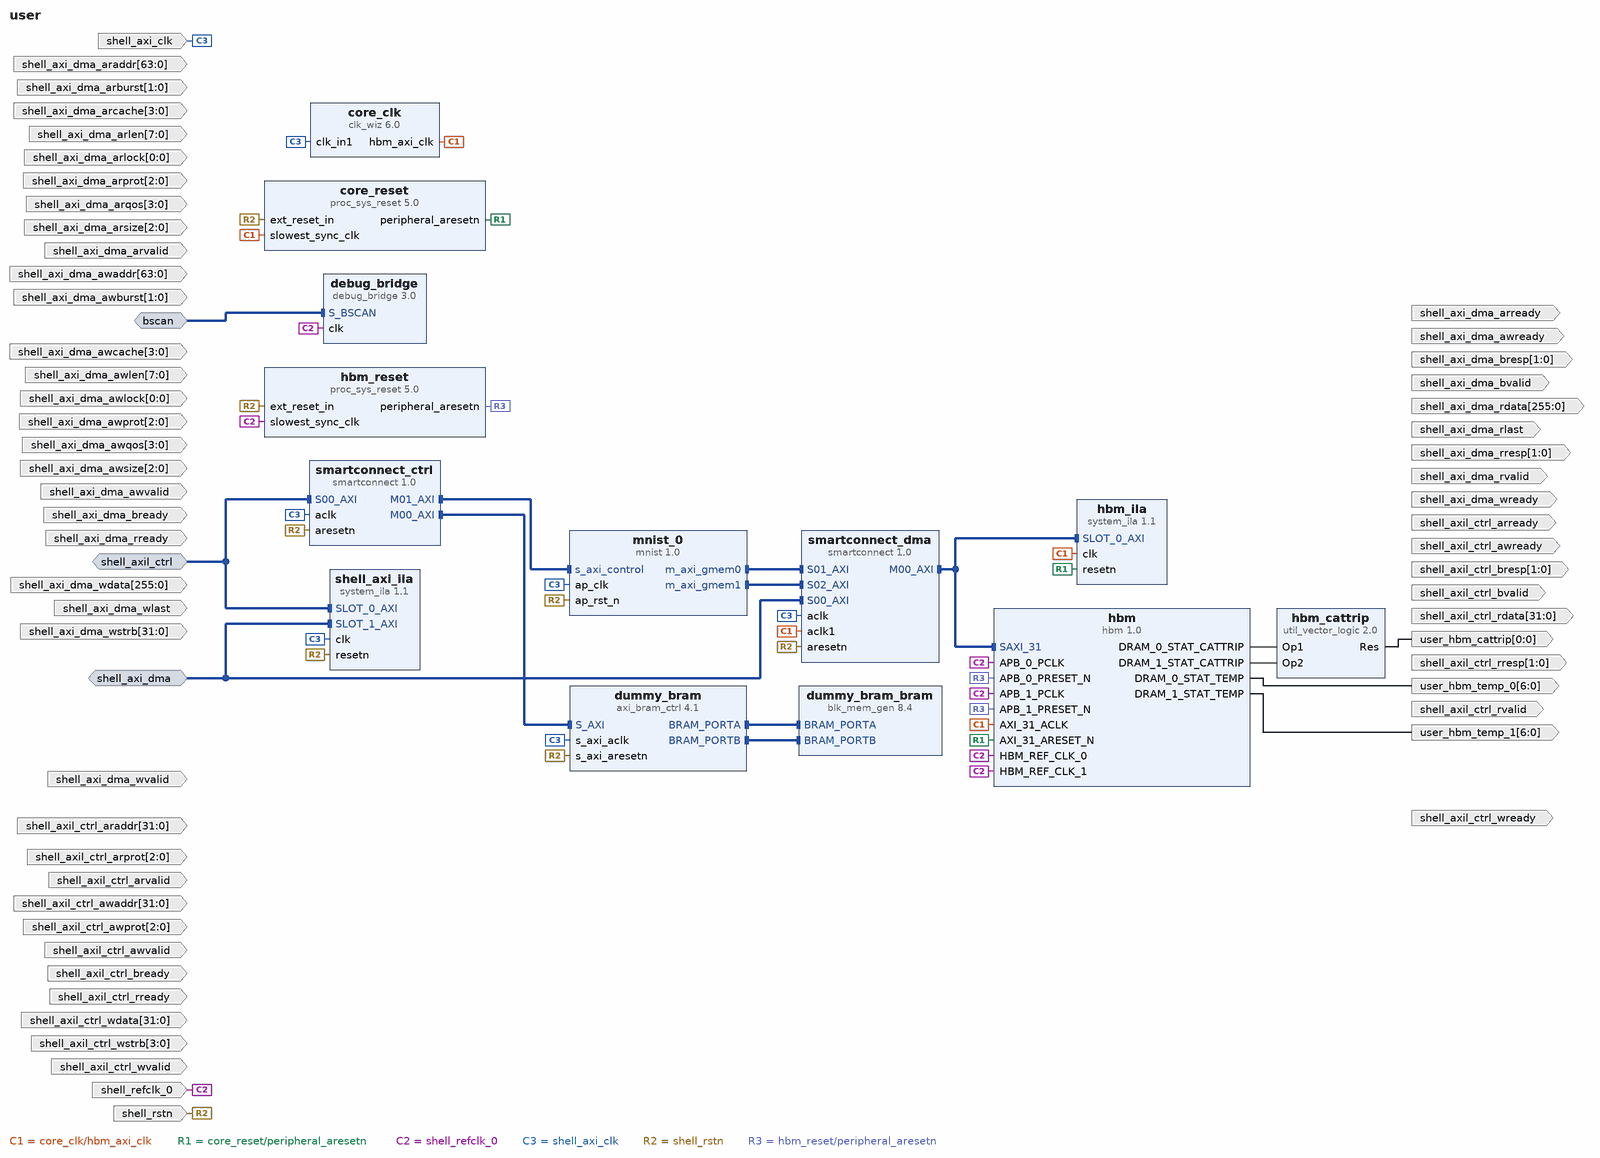
[diagram p0: block diagram of the top level]
# Vivado block design user, xcu55n-fsvh2892-2L-e, Vivado 2022.2
create_bd_design user

create_bd_intf_port -mode Slave -vlnv xilinx.com:interface:aximm_rtl:1.0 shell_axi_dma
set_property -dict [list \
  CONFIG.ADDR_WIDTH 64 \
  CONFIG.ARUSER_WIDTH 0 \
  CONFIG.AWUSER_WIDTH 0 \
  CONFIG.BUSER_WIDTH 0 \
  CONFIG.DATA_WIDTH 256 \
  CONFIG.FREQ_HZ 250000000 \
  CONFIG.HAS_BRESP 1 \
  CONFIG.HAS_BURST 1 \
  CONFIG.HAS_CACHE 1 \
  CONFIG.HAS_LOCK 1 \
  CONFIG.HAS_PROT 1 \
  CONFIG.HAS_QOS 1 \
  CONFIG.HAS_REGION 0 \
  CONFIG.HAS_RRESP 1 \
  CONFIG.HAS_WSTRB 1 \
  CONFIG.ID_WIDTH 0 \
  CONFIG.MAX_BURST_LENGTH 256 \
  CONFIG.NUM_READ_OUTSTANDING 32 \
  CONFIG.NUM_READ_THREADS 1 \
  CONFIG.NUM_WRITE_OUTSTANDING 16 \
  CONFIG.NUM_WRITE_THREADS 1 \
  CONFIG.PROTOCOL AXI4 \
  CONFIG.READ_WRITE_MODE READ_WRITE \
  CONFIG.RUSER_BITS_PER_BYTE 0 \
  CONFIG.RUSER_WIDTH 0 \
  CONFIG.SUPPORTS_NARROW_BURST 0 \
  CONFIG.WUSER_BITS_PER_BYTE 0 \
  CONFIG.WUSER_WIDTH 0 \
  CONFIG.master_id 1 \
] [get_bd_intf_ports shell_axi_dma]
create_bd_intf_port -mode Slave -vlnv xilinx.com:interface:aximm_rtl:1.0 shell_axil_ctrl
set_property -dict [list \
  CONFIG.ADDR_WIDTH 32 \
  CONFIG.ARUSER_WIDTH 0 \
  CONFIG.AWUSER_WIDTH 0 \
  CONFIG.BUSER_WIDTH 0 \
  CONFIG.DATA_WIDTH 32 \
  CONFIG.FREQ_HZ 250000000 \
  CONFIG.HAS_BRESP 1 \
  CONFIG.HAS_BURST 0 \
  CONFIG.HAS_CACHE 0 \
  CONFIG.HAS_LOCK 0 \
  CONFIG.HAS_PROT 1 \
  CONFIG.HAS_QOS 0 \
  CONFIG.HAS_REGION 0 \
  CONFIG.HAS_RRESP 1 \
  CONFIG.HAS_WSTRB 1 \
  CONFIG.ID_WIDTH 0 \
  CONFIG.MAX_BURST_LENGTH 1 \
  CONFIG.NUM_READ_OUTSTANDING 1 \
  CONFIG.NUM_READ_THREADS 1 \
  CONFIG.NUM_WRITE_OUTSTANDING 1 \
  CONFIG.NUM_WRITE_THREADS 1 \
  CONFIG.PROTOCOL AXI4LITE \
  CONFIG.READ_WRITE_MODE READ_WRITE \
  CONFIG.RUSER_BITS_PER_BYTE 0 \
  CONFIG.RUSER_WIDTH 0 \
  CONFIG.SUPPORTS_NARROW_BURST 0 \
  CONFIG.WUSER_BITS_PER_BYTE 0 \
  CONFIG.WUSER_WIDTH 0 \
  CONFIG.master_id 1 \
] [get_bd_intf_ports shell_axil_ctrl]
create_bd_intf_port -mode Slave -vlnv xilinx.com:interface:bscan_rtl:1.0 bscan
create_bd_port -dir I -from 63 -to 0 shell_axi_dma_awaddr
create_bd_port -dir I -from 7 -to 0 shell_axi_dma_awlen
create_bd_port -dir I -from 2 -to 0 shell_axi_dma_awsize
create_bd_port -dir I -from 1 -to 0 shell_axi_dma_awburst
create_bd_port -dir I -from 0 -to 0 shell_axi_dma_awlock
create_bd_port -dir I -from 3 -to 0 shell_axi_dma_awcache
create_bd_port -dir I -from 2 -to 0 shell_axi_dma_awprot
create_bd_port -dir I -from 3 -to 0 shell_axi_dma_awqos
create_bd_port -dir I shell_axi_dma_awvalid
create_bd_port -dir O shell_axi_dma_awready
create_bd_port -dir I -from 255 -to 0 shell_axi_dma_wdata
create_bd_port -dir I -from 31 -to 0 shell_axi_dma_wstrb
create_bd_port -dir I shell_axi_dma_wlast
create_bd_port -dir I shell_axi_dma_wvalid
create_bd_port -dir O shell_axi_dma_wready
create_bd_port -dir O -from 1 -to 0 shell_axi_dma_bresp
create_bd_port -dir O shell_axi_dma_bvalid
create_bd_port -dir I shell_axi_dma_bready
create_bd_port -dir I -from 63 -to 0 shell_axi_dma_araddr
create_bd_port -dir I -from 7 -to 0 shell_axi_dma_arlen
create_bd_port -dir I -from 2 -to 0 shell_axi_dma_arsize
create_bd_port -dir I -from 1 -to 0 shell_axi_dma_arburst
create_bd_port -dir I -from 0 -to 0 shell_axi_dma_arlock
create_bd_port -dir I -from 3 -to 0 shell_axi_dma_arcache
create_bd_port -dir I -from 2 -to 0 shell_axi_dma_arprot
create_bd_port -dir I -from 3 -to 0 shell_axi_dma_arqos
create_bd_port -dir I shell_axi_dma_arvalid
create_bd_port -dir O shell_axi_dma_arready
create_bd_port -dir O -from 255 -to 0 shell_axi_dma_rdata
create_bd_port -dir O -from 1 -to 0 shell_axi_dma_rresp
create_bd_port -dir O shell_axi_dma_rlast
create_bd_port -dir O shell_axi_dma_rvalid
create_bd_port -dir I shell_axi_dma_rready
create_bd_port -dir I -from 31 -to 0 shell_axil_ctrl_awaddr
create_bd_port -dir I -from 2 -to 0 shell_axil_ctrl_awprot
create_bd_port -dir I shell_axil_ctrl_awvalid
create_bd_port -dir O shell_axil_ctrl_awready
create_bd_port -dir I -from 31 -to 0 shell_axil_ctrl_wdata
create_bd_port -dir I -from 3 -to 0 shell_axil_ctrl_wstrb
create_bd_port -dir I shell_axil_ctrl_wvalid
create_bd_port -dir O shell_axil_ctrl_wready
create_bd_port -dir O -from 1 -to 0 shell_axil_ctrl_bresp
create_bd_port -dir O shell_axil_ctrl_bvalid
create_bd_port -dir I shell_axil_ctrl_bready
create_bd_port -dir I -from 31 -to 0 shell_axil_ctrl_araddr
create_bd_port -dir I -from 2 -to 0 shell_axil_ctrl_arprot
create_bd_port -dir I shell_axil_ctrl_arvalid
create_bd_port -dir O shell_axil_ctrl_arready
create_bd_port -dir O -from 31 -to 0 shell_axil_ctrl_rdata
create_bd_port -dir O -from 1 -to 0 shell_axil_ctrl_rresp
create_bd_port -dir O shell_axil_ctrl_rvalid
create_bd_port -dir I shell_axil_ctrl_rready
create_bd_port -dir I -type clk shell_axi_clk
set_property -dict [list \
  CONFIG.ASSOCIATED_BUSIF shell_axi_dma:shell_axil_ctrl \
  CONFIG.ASSOCIATED_RESET shell_rstn \
  CONFIG.FREQ_HZ 250000000 \
] [get_bd_ports shell_axi_clk]
create_bd_port -dir I -type clk shell_refclk_0
set_property -dict {CONFIG.FREQ_HZ 100000000} [get_bd_ports shell_refclk_0]
create_bd_port -dir I -type rst shell_rstn
create_bd_port -dir O -from 0 -to 0 -type intr user_hbm_cattrip
create_bd_port -dir O -from 6 -to 0 -type data user_hbm_temp_0
create_bd_port -dir O -from 6 -to 0 -type data user_hbm_temp_1

create_bd_cell -type ip -vlnv xilinx.com:ip:clk_wiz:6.0 core_clk
set_property -dict [list \
  CONFIG.CLKOUT1_JITTER 104.289 \
  CONFIG.CLKOUT1_PHASE_ERROR 153.873 \
  CONFIG.CLKOUT1_REQUESTED_OUT_FREQ 450 \
  CONFIG.CLK_OUT1_PORT hbm_axi_clk \
  CONFIG.ENABLE_CDDC false \
  CONFIG.MMCM_CLKFBOUT_MULT_F 23.625 \
  CONFIG.MMCM_CLKOUT0_DIVIDE_F 2.625 \
  CONFIG.MMCM_DIVCLK_DIVIDE 5 \
  CONFIG.PRIM_SOURCE No_buffer \
  CONFIG.RESET_PORT reset \
  CONFIG.RESET_TYPE ACTIVE_HIGH \
  CONFIG.USE_LOCKED false \
  CONFIG.USE_RESET false \
] [get_bd_cells core_clk]
create_bd_cell -type ip -vlnv xilinx.com:ip:proc_sys_reset:5.0 core_reset
create_bd_cell -type ip -vlnv xilinx.com:ip:hbm:1.0 hbm
set_property -dict [list \
  CONFIG.USER_APB_EN false \
  CONFIG.USER_HBM_DENSITY 8GB \
  CONFIG.USER_SAXI_00 false \
  CONFIG.USER_SAXI_01 false \
  CONFIG.USER_SAXI_02 false \
  CONFIG.USER_SAXI_03 false \
  CONFIG.USER_SAXI_04 false \
  CONFIG.USER_SAXI_05 false \
  CONFIG.USER_SAXI_06 false \
  CONFIG.USER_SAXI_07 false \
  CONFIG.USER_SAXI_08 false \
  CONFIG.USER_SAXI_09 false \
  CONFIG.USER_SAXI_10 false \
  CONFIG.USER_SAXI_11 false \
  CONFIG.USER_SAXI_12 false \
  CONFIG.USER_SAXI_13 false \
  CONFIG.USER_SAXI_14 false \
  CONFIG.USER_SAXI_15 false \
  CONFIG.USER_SAXI_16 false \
  CONFIG.USER_SAXI_17 false \
  CONFIG.USER_SAXI_18 false \
  CONFIG.USER_SAXI_19 false \
  CONFIG.USER_SAXI_20 false \
  CONFIG.USER_SAXI_21 false \
  CONFIG.USER_SAXI_22 false \
  CONFIG.USER_SAXI_23 false \
  CONFIG.USER_SAXI_24 false \
  CONFIG.USER_SAXI_25 false \
  CONFIG.USER_SAXI_26 false \
  CONFIG.USER_SAXI_27 false \
  CONFIG.USER_SAXI_28 false \
  CONFIG.USER_SAXI_29 false \
  CONFIG.USER_SAXI_30 false \
  CONFIG.USER_SAXI_31 true \
  CONFIG.USER_XSDB_INTF_EN TRUE \
] [get_bd_cells hbm]
create_bd_cell -type ip -vlnv xilinx.com:ip:util_vector_logic:2.0 hbm_cattrip
set_property -dict {CONFIG.C_OPERATION or CONFIG.C_SIZE 1} [get_bd_cells hbm_cattrip]
create_bd_cell -type ip -vlnv xilinx.com:ip:proc_sys_reset:5.0 hbm_reset
create_bd_cell -type ip -vlnv xilinx.com:ip:smartconnect:1.0 smartconnect_ctrl
set_property -dict {CONFIG.NUM_CLKS 1 CONFIG.NUM_MI 2 CONFIG.NUM_SI 1} [get_bd_cells smartconnect_ctrl]
create_bd_cell -type ip -vlnv xilinx.com:ip:debug_bridge:3.0 debug_bridge
set_property -dict {CONFIG.C_DESIGN_TYPE 1 CONFIG.C_NUM_BS_MASTER 0} [get_bd_cells debug_bridge]
create_bd_cell -type ip -vlnv xilinx.com:ip:system_ila:1.1 shell_axi_ila
set_property -dict [list \
  CONFIG.C_NUM_MONITOR_SLOTS 2 \
  CONFIG.C_SLOT 1 \
  CONFIG.C_SLOT_0_MAX_RD_BURSTS 32 \
  CONFIG.C_SLOT_0_MAX_WR_BURSTS 32 \
  CONFIG.C_SLOT_0_TXN_CNTR_EN 0 \
  CONFIG.C_SLOT_1_MAX_RD_BURSTS 32 \
  CONFIG.C_SLOT_1_MAX_WR_BURSTS 32 \
] [get_bd_cells shell_axi_ila]
create_bd_cell -type ip -vlnv xilinx.com:ip:axi_bram_ctrl:4.1 dummy_bram
create_bd_cell -type ip -vlnv xilinx.com:ip:blk_mem_gen:8.4 dummy_bram_bram
set_property -dict {CONFIG.Memory_Type True_Dual_Port_RAM} [get_bd_cells dummy_bram_bram]
create_bd_cell -type ip -vlnv xilinx.com:ip:system_ila:1.1 hbm_ila
set_property -dict {CONFIG.C_SLOT_0_MAX_RD_BURSTS 16 CONFIG.C_SLOT_0_MAX_WR_BURSTS 16} [get_bd_cells hbm_ila]
create_bd_cell -type ip -vlnv xilinx.com:ip:smartconnect:1.0 smartconnect_dma
set_property -dict {CONFIG.NUM_CLKS 2 CONFIG.NUM_SI 3} [get_bd_cells smartconnect_dma]
create_bd_cell -type ip -vlnv xilinx.com:hls:mnist:1.0 mnist_0

# ---- connections ----

connect_bd_intf_net [get_bd_intf_ports bscan] [get_bd_intf_pins debug_bridge/S_BSCAN]
connect_bd_intf_net [get_bd_intf_pins dummy_bram_bram/BRAM_PORTA] [get_bd_intf_pins dummy_bram/BRAM_PORTA]
connect_bd_intf_net [get_bd_intf_pins dummy_bram_bram/BRAM_PORTB] [get_bd_intf_pins dummy_bram/BRAM_PORTB]
connect_bd_intf_net [get_bd_intf_pins mnist_0/m_axi_gmem0] [get_bd_intf_pins smartconnect_dma/S01_AXI]
connect_bd_intf_net [get_bd_intf_pins mnist_0/m_axi_gmem1] [get_bd_intf_pins smartconnect_dma/S02_AXI]
connect_bd_intf_net [get_bd_intf_ports shell_axi_dma] [get_bd_intf_pins smartconnect_dma/S00_AXI]
connect_bd_intf_net [get_bd_intf_ports shell_axi_dma] [get_bd_intf_pins shell_axi_ila/SLOT_1_AXI]
connect_bd_intf_net [get_bd_intf_ports shell_axil_ctrl] [get_bd_intf_pins smartconnect_ctrl/S00_AXI]
connect_bd_intf_net [get_bd_intf_ports shell_axil_ctrl] [get_bd_intf_pins shell_axi_ila/SLOT_0_AXI]
connect_bd_intf_net [get_bd_intf_pins dummy_bram/S_AXI] [get_bd_intf_pins smartconnect_ctrl/M00_AXI]
connect_bd_intf_net [get_bd_intf_pins mnist_0/s_axi_control] [get_bd_intf_pins smartconnect_ctrl/M01_AXI]
connect_bd_intf_net [get_bd_intf_pins hbm/SAXI_31] [get_bd_intf_pins smartconnect_dma/M00_AXI]
connect_bd_intf_net [get_bd_intf_pins hbm/SAXI_31] [get_bd_intf_pins hbm_ila/SLOT_0_AXI]
connect_bd_net [get_bd_pins core_clk/hbm_axi_clk] \
  [get_bd_pins core_reset/slowest_sync_clk] [get_bd_pins hbm/AXI_31_ACLK] [get_bd_pins hbm_ila/clk] \
  [get_bd_pins smartconnect_dma/aclk1]
connect_bd_net [get_bd_pins core_reset/peripheral_aresetn] [get_bd_pins hbm/AXI_31_ARESET_N] [get_bd_pins hbm_ila/resetn]
connect_bd_net [get_bd_pins hbm/DRAM_0_STAT_CATTRIP] [get_bd_pins hbm_cattrip/Op1]
connect_bd_net [get_bd_pins hbm/DRAM_0_STAT_TEMP] [get_bd_ports user_hbm_temp_0]
connect_bd_net [get_bd_pins hbm/DRAM_1_STAT_CATTRIP] [get_bd_pins hbm_cattrip/Op2]
connect_bd_net [get_bd_pins hbm/DRAM_1_STAT_TEMP] [get_bd_ports user_hbm_temp_1]
connect_bd_net [get_bd_pins hbm_cattrip/Res] [get_bd_ports user_hbm_cattrip]
connect_bd_net -net hbm_refclk_buf_IBUF_OUT [get_bd_ports shell_refclk_0] \
  [get_bd_pins hbm/HBM_REF_CLK_0] [get_bd_pins hbm/HBM_REF_CLK_1] [get_bd_pins hbm_reset/slowest_sync_clk] \
  [get_bd_pins hbm/APB_0_PCLK] [get_bd_pins hbm/APB_1_PCLK] [get_bd_pins debug_bridge/clk]
connect_bd_net [get_bd_ports shell_axi_clk] \
  [get_bd_pins core_clk/clk_in1] [get_bd_pins smartconnect_ctrl/aclk] [get_bd_pins shell_axi_ila/clk] \
  [get_bd_pins dummy_bram/s_axi_aclk] [get_bd_pins smartconnect_dma/aclk] [get_bd_pins mnist_0/ap_clk]
connect_bd_net [get_bd_ports shell_rstn] \
  [get_bd_pins core_reset/ext_reset_in] [get_bd_pins hbm_reset/ext_reset_in] [get_bd_pins smartconnect_ctrl/aresetn] \
  [get_bd_pins shell_axi_ila/resetn] [get_bd_pins dummy_bram/s_axi_aresetn] [get_bd_pins smartconnect_dma/aresetn] \
  [get_bd_pins mnist_0/ap_rst_n]
connect_bd_net -net sys_reset_peripheral_aresetn [get_bd_pins hbm_reset/peripheral_aresetn] \
  [get_bd_pins hbm/APB_0_PRESET_N] [get_bd_pins hbm/APB_1_PRESET_N]

# ---- address map ----
assign_bd_address -offset 0x0000000000000000 -range 256M -target_address_space [get_bd_addr_spaces mnist_0/Data_m_axi_gmem0] [get_bd_addr_segs hbm/SAXI_31/HBM_MEM00]
assign_bd_address -offset 0x0000000010000000 -range 256M -target_address_space [get_bd_addr_spaces mnist_0/Data_m_axi_gmem0] [get_bd_addr_segs hbm/SAXI_31/HBM_MEM01]
assign_bd_address -offset 0x0000000020000000 -range 256M -target_address_space [get_bd_addr_spaces mnist_0/Data_m_axi_gmem0] [get_bd_addr_segs hbm/SAXI_31/HBM_MEM02]
assign_bd_address -offset 0x0000000030000000 -range 256M -target_address_space [get_bd_addr_spaces mnist_0/Data_m_axi_gmem0] [get_bd_addr_segs hbm/SAXI_31/HBM_MEM03]
assign_bd_address -offset 0x0000000040000000 -range 256M -target_address_space [get_bd_addr_spaces mnist_0/Data_m_axi_gmem0] [get_bd_addr_segs hbm/SAXI_31/HBM_MEM04]
assign_bd_address -offset 0x0000000050000000 -range 256M -target_address_space [get_bd_addr_spaces mnist_0/Data_m_axi_gmem0] [get_bd_addr_segs hbm/SAXI_31/HBM_MEM05]
assign_bd_address -offset 0x0000000060000000 -range 256M -target_address_space [get_bd_addr_spaces mnist_0/Data_m_axi_gmem0] [get_bd_addr_segs hbm/SAXI_31/HBM_MEM06]
assign_bd_address -offset 0x0000000070000000 -range 256M -target_address_space [get_bd_addr_spaces mnist_0/Data_m_axi_gmem0] [get_bd_addr_segs hbm/SAXI_31/HBM_MEM07]
assign_bd_address -offset 0x0000000080000000 -range 256M -target_address_space [get_bd_addr_spaces mnist_0/Data_m_axi_gmem0] [get_bd_addr_segs hbm/SAXI_31/HBM_MEM08]
assign_bd_address -offset 0x0000000090000000 -range 256M -target_address_space [get_bd_addr_spaces mnist_0/Data_m_axi_gmem0] [get_bd_addr_segs hbm/SAXI_31/HBM_MEM09]
assign_bd_address -offset 0x00000000A0000000 -range 256M -target_address_space [get_bd_addr_spaces mnist_0/Data_m_axi_gmem0] [get_bd_addr_segs hbm/SAXI_31/HBM_MEM10]
assign_bd_address -offset 0x00000000B0000000 -range 256M -target_address_space [get_bd_addr_spaces mnist_0/Data_m_axi_gmem0] [get_bd_addr_segs hbm/SAXI_31/HBM_MEM11]
assign_bd_address -offset 0x00000000C0000000 -range 256M -target_address_space [get_bd_addr_spaces mnist_0/Data_m_axi_gmem0] [get_bd_addr_segs hbm/SAXI_31/HBM_MEM12]
assign_bd_address -offset 0x00000000D0000000 -range 256M -target_address_space [get_bd_addr_spaces mnist_0/Data_m_axi_gmem0] [get_bd_addr_segs hbm/SAXI_31/HBM_MEM13]
assign_bd_address -offset 0x00000000E0000000 -range 256M -target_address_space [get_bd_addr_spaces mnist_0/Data_m_axi_gmem0] [get_bd_addr_segs hbm/SAXI_31/HBM_MEM14]
assign_bd_address -offset 0x00000000F0000000 -range 256M -target_address_space [get_bd_addr_spaces mnist_0/Data_m_axi_gmem0] [get_bd_addr_segs hbm/SAXI_31/HBM_MEM15]
assign_bd_address -offset 0x0000000100000000 -range 256M -target_address_space [get_bd_addr_spaces mnist_0/Data_m_axi_gmem0] [get_bd_addr_segs hbm/SAXI_31/HBM_MEM16]
assign_bd_address -offset 0x0000000110000000 -range 256M -target_address_space [get_bd_addr_spaces mnist_0/Data_m_axi_gmem0] [get_bd_addr_segs hbm/SAXI_31/HBM_MEM17]
assign_bd_address -offset 0x0000000120000000 -range 256M -target_address_space [get_bd_addr_spaces mnist_0/Data_m_axi_gmem0] [get_bd_addr_segs hbm/SAXI_31/HBM_MEM18]
assign_bd_address -offset 0x0000000130000000 -range 256M -target_address_space [get_bd_addr_spaces mnist_0/Data_m_axi_gmem0] [get_bd_addr_segs hbm/SAXI_31/HBM_MEM19]
assign_bd_address -offset 0x0000000140000000 -range 256M -target_address_space [get_bd_addr_spaces mnist_0/Data_m_axi_gmem0] [get_bd_addr_segs hbm/SAXI_31/HBM_MEM20]
assign_bd_address -offset 0x0000000150000000 -range 256M -target_address_space [get_bd_addr_spaces mnist_0/Data_m_axi_gmem0] [get_bd_addr_segs hbm/SAXI_31/HBM_MEM21]
assign_bd_address -offset 0x0000000160000000 -range 256M -target_address_space [get_bd_addr_spaces mnist_0/Data_m_axi_gmem0] [get_bd_addr_segs hbm/SAXI_31/HBM_MEM22]
assign_bd_address -offset 0x0000000170000000 -range 256M -target_address_space [get_bd_addr_spaces mnist_0/Data_m_axi_gmem0] [get_bd_addr_segs hbm/SAXI_31/HBM_MEM23]
assign_bd_address -offset 0x0000000180000000 -range 256M -target_address_space [get_bd_addr_spaces mnist_0/Data_m_axi_gmem0] [get_bd_addr_segs hbm/SAXI_31/HBM_MEM24]
assign_bd_address -offset 0x0000000190000000 -range 256M -target_address_space [get_bd_addr_spaces mnist_0/Data_m_axi_gmem0] [get_bd_addr_segs hbm/SAXI_31/HBM_MEM25]
assign_bd_address -offset 0x00000001A0000000 -range 256M -target_address_space [get_bd_addr_spaces mnist_0/Data_m_axi_gmem0] [get_bd_addr_segs hbm/SAXI_31/HBM_MEM26]
assign_bd_address -offset 0x00000001B0000000 -range 256M -target_address_space [get_bd_addr_spaces mnist_0/Data_m_axi_gmem0] [get_bd_addr_segs hbm/SAXI_31/HBM_MEM27]
assign_bd_address -offset 0x00000001C0000000 -range 256M -target_address_space [get_bd_addr_spaces mnist_0/Data_m_axi_gmem0] [get_bd_addr_segs hbm/SAXI_31/HBM_MEM28]
assign_bd_address -offset 0x00000001D0000000 -range 256M -target_address_space [get_bd_addr_spaces mnist_0/Data_m_axi_gmem0] [get_bd_addr_segs hbm/SAXI_31/HBM_MEM29]
assign_bd_address -offset 0x00000001E0000000 -range 256M -target_address_space [get_bd_addr_spaces mnist_0/Data_m_axi_gmem0] [get_bd_addr_segs hbm/SAXI_31/HBM_MEM30]
assign_bd_address -offset 0x00000001F0000000 -range 256M -target_address_space [get_bd_addr_spaces mnist_0/Data_m_axi_gmem0] [get_bd_addr_segs hbm/SAXI_31/HBM_MEM31]
assign_bd_address -offset 0x0000000000000000 -range 256M -target_address_space [get_bd_addr_spaces mnist_0/Data_m_axi_gmem1] [get_bd_addr_segs hbm/SAXI_31/HBM_MEM00]
assign_bd_address -offset 0x0000000010000000 -range 256M -target_address_space [get_bd_addr_spaces mnist_0/Data_m_axi_gmem1] [get_bd_addr_segs hbm/SAXI_31/HBM_MEM01]
assign_bd_address -offset 0x0000000020000000 -range 256M -target_address_space [get_bd_addr_spaces mnist_0/Data_m_axi_gmem1] [get_bd_addr_segs hbm/SAXI_31/HBM_MEM02]
assign_bd_address -offset 0x0000000030000000 -range 256M -target_address_space [get_bd_addr_spaces mnist_0/Data_m_axi_gmem1] [get_bd_addr_segs hbm/SAXI_31/HBM_MEM03]
assign_bd_address -offset 0x0000000040000000 -range 256M -target_address_space [get_bd_addr_spaces mnist_0/Data_m_axi_gmem1] [get_bd_addr_segs hbm/SAXI_31/HBM_MEM04]
assign_bd_address -offset 0x0000000050000000 -range 256M -target_address_space [get_bd_addr_spaces mnist_0/Data_m_axi_gmem1] [get_bd_addr_segs hbm/SAXI_31/HBM_MEM05]
assign_bd_address -offset 0x0000000060000000 -range 256M -target_address_space [get_bd_addr_spaces mnist_0/Data_m_axi_gmem1] [get_bd_addr_segs hbm/SAXI_31/HBM_MEM06]
assign_bd_address -offset 0x0000000070000000 -range 256M -target_address_space [get_bd_addr_spaces mnist_0/Data_m_axi_gmem1] [get_bd_addr_segs hbm/SAXI_31/HBM_MEM07]
assign_bd_address -offset 0x0000000080000000 -range 256M -target_address_space [get_bd_addr_spaces mnist_0/Data_m_axi_gmem1] [get_bd_addr_segs hbm/SAXI_31/HBM_MEM08]
assign_bd_address -offset 0x0000000090000000 -range 256M -target_address_space [get_bd_addr_spaces mnist_0/Data_m_axi_gmem1] [get_bd_addr_segs hbm/SAXI_31/HBM_MEM09]
assign_bd_address -offset 0x00000000A0000000 -range 256M -target_address_space [get_bd_addr_spaces mnist_0/Data_m_axi_gmem1] [get_bd_addr_segs hbm/SAXI_31/HBM_MEM10]
assign_bd_address -offset 0x00000000B0000000 -range 256M -target_address_space [get_bd_addr_spaces mnist_0/Data_m_axi_gmem1] [get_bd_addr_segs hbm/SAXI_31/HBM_MEM11]
assign_bd_address -offset 0x00000000C0000000 -range 256M -target_address_space [get_bd_addr_spaces mnist_0/Data_m_axi_gmem1] [get_bd_addr_segs hbm/SAXI_31/HBM_MEM12]
assign_bd_address -offset 0x00000000D0000000 -range 256M -target_address_space [get_bd_addr_spaces mnist_0/Data_m_axi_gmem1] [get_bd_addr_segs hbm/SAXI_31/HBM_MEM13]
assign_bd_address -offset 0x00000000E0000000 -range 256M -target_address_space [get_bd_addr_spaces mnist_0/Data_m_axi_gmem1] [get_bd_addr_segs hbm/SAXI_31/HBM_MEM14]
assign_bd_address -offset 0x00000000F0000000 -range 256M -target_address_space [get_bd_addr_spaces mnist_0/Data_m_axi_gmem1] [get_bd_addr_segs hbm/SAXI_31/HBM_MEM15]
assign_bd_address -offset 0x0000000100000000 -range 256M -target_address_space [get_bd_addr_spaces mnist_0/Data_m_axi_gmem1] [get_bd_addr_segs hbm/SAXI_31/HBM_MEM16]
assign_bd_address -offset 0x0000000110000000 -range 256M -target_address_space [get_bd_addr_spaces mnist_0/Data_m_axi_gmem1] [get_bd_addr_segs hbm/SAXI_31/HBM_MEM17]
assign_bd_address -offset 0x0000000120000000 -range 256M -target_address_space [get_bd_addr_spaces mnist_0/Data_m_axi_gmem1] [get_bd_addr_segs hbm/SAXI_31/HBM_MEM18]
assign_bd_address -offset 0x0000000130000000 -range 256M -target_address_space [get_bd_addr_spaces mnist_0/Data_m_axi_gmem1] [get_bd_addr_segs hbm/SAXI_31/HBM_MEM19]
assign_bd_address -offset 0x0000000140000000 -range 256M -target_address_space [get_bd_addr_spaces mnist_0/Data_m_axi_gmem1] [get_bd_addr_segs hbm/SAXI_31/HBM_MEM20]
assign_bd_address -offset 0x0000000150000000 -range 256M -target_address_space [get_bd_addr_spaces mnist_0/Data_m_axi_gmem1] [get_bd_addr_segs hbm/SAXI_31/HBM_MEM21]
assign_bd_address -offset 0x0000000160000000 -range 256M -target_address_space [get_bd_addr_spaces mnist_0/Data_m_axi_gmem1] [get_bd_addr_segs hbm/SAXI_31/HBM_MEM22]
assign_bd_address -offset 0x0000000170000000 -range 256M -target_address_space [get_bd_addr_spaces mnist_0/Data_m_axi_gmem1] [get_bd_addr_segs hbm/SAXI_31/HBM_MEM23]
assign_bd_address -offset 0x0000000180000000 -range 256M -target_address_space [get_bd_addr_spaces mnist_0/Data_m_axi_gmem1] [get_bd_addr_segs hbm/SAXI_31/HBM_MEM24]
assign_bd_address -offset 0x0000000190000000 -range 256M -target_address_space [get_bd_addr_spaces mnist_0/Data_m_axi_gmem1] [get_bd_addr_segs hbm/SAXI_31/HBM_MEM25]
assign_bd_address -offset 0x00000001A0000000 -range 256M -target_address_space [get_bd_addr_spaces mnist_0/Data_m_axi_gmem1] [get_bd_addr_segs hbm/SAXI_31/HBM_MEM26]
assign_bd_address -offset 0x00000001B0000000 -range 256M -target_address_space [get_bd_addr_spaces mnist_0/Data_m_axi_gmem1] [get_bd_addr_segs hbm/SAXI_31/HBM_MEM27]
assign_bd_address -offset 0x00000001C0000000 -range 256M -target_address_space [get_bd_addr_spaces mnist_0/Data_m_axi_gmem1] [get_bd_addr_segs hbm/SAXI_31/HBM_MEM28]
assign_bd_address -offset 0x00000001D0000000 -range 256M -target_address_space [get_bd_addr_spaces mnist_0/Data_m_axi_gmem1] [get_bd_addr_segs hbm/SAXI_31/HBM_MEM29]
assign_bd_address -offset 0x00000001E0000000 -range 256M -target_address_space [get_bd_addr_spaces mnist_0/Data_m_axi_gmem1] [get_bd_addr_segs hbm/SAXI_31/HBM_MEM30]
assign_bd_address -offset 0x00000001F0000000 -range 256M -target_address_space [get_bd_addr_spaces mnist_0/Data_m_axi_gmem1] [get_bd_addr_segs hbm/SAXI_31/HBM_MEM31]
assign_bd_address -offset 0x0000000000000000 -range 256M -target_address_space [get_bd_addr_spaces shell_axi_dma] [get_bd_addr_segs hbm/SAXI_31/HBM_MEM00]
assign_bd_address -offset 0x0000000010000000 -range 256M -target_address_space [get_bd_addr_spaces shell_axi_dma] [get_bd_addr_segs hbm/SAXI_31/HBM_MEM01]
assign_bd_address -offset 0x0000000020000000 -range 256M -target_address_space [get_bd_addr_spaces shell_axi_dma] [get_bd_addr_segs hbm/SAXI_31/HBM_MEM02]
assign_bd_address -offset 0x0000000030000000 -range 256M -target_address_space [get_bd_addr_spaces shell_axi_dma] [get_bd_addr_segs hbm/SAXI_31/HBM_MEM03]
assign_bd_address -offset 0x0000000040000000 -range 256M -target_address_space [get_bd_addr_spaces shell_axi_dma] [get_bd_addr_segs hbm/SAXI_31/HBM_MEM04]
assign_bd_address -offset 0x0000000050000000 -range 256M -target_address_space [get_bd_addr_spaces shell_axi_dma] [get_bd_addr_segs hbm/SAXI_31/HBM_MEM05]
assign_bd_address -offset 0x0000000060000000 -range 256M -target_address_space [get_bd_addr_spaces shell_axi_dma] [get_bd_addr_segs hbm/SAXI_31/HBM_MEM06]
assign_bd_address -offset 0x0000000070000000 -range 256M -target_address_space [get_bd_addr_spaces shell_axi_dma] [get_bd_addr_segs hbm/SAXI_31/HBM_MEM07]
assign_bd_address -offset 0x0000000080000000 -range 256M -target_address_space [get_bd_addr_spaces shell_axi_dma] [get_bd_addr_segs hbm/SAXI_31/HBM_MEM08]
assign_bd_address -offset 0x0000000090000000 -range 256M -target_address_space [get_bd_addr_spaces shell_axi_dma] [get_bd_addr_segs hbm/SAXI_31/HBM_MEM09]
assign_bd_address -offset 0x00000000A0000000 -range 256M -target_address_space [get_bd_addr_spaces shell_axi_dma] [get_bd_addr_segs hbm/SAXI_31/HBM_MEM10]
assign_bd_address -offset 0x00000000B0000000 -range 256M -target_address_space [get_bd_addr_spaces shell_axi_dma] [get_bd_addr_segs hbm/SAXI_31/HBM_MEM11]
assign_bd_address -offset 0x00000000C0000000 -range 256M -target_address_space [get_bd_addr_spaces shell_axi_dma] [get_bd_addr_segs hbm/SAXI_31/HBM_MEM12]
assign_bd_address -offset 0x00000000D0000000 -range 256M -target_address_space [get_bd_addr_spaces shell_axi_dma] [get_bd_addr_segs hbm/SAXI_31/HBM_MEM13]
assign_bd_address -offset 0x00000000E0000000 -range 256M -target_address_space [get_bd_addr_spaces shell_axi_dma] [get_bd_addr_segs hbm/SAXI_31/HBM_MEM14]
assign_bd_address -offset 0x00000000F0000000 -range 256M -target_address_space [get_bd_addr_spaces shell_axi_dma] [get_bd_addr_segs hbm/SAXI_31/HBM_MEM15]
assign_bd_address -offset 0x0000000100000000 -range 256M -target_address_space [get_bd_addr_spaces shell_axi_dma] [get_bd_addr_segs hbm/SAXI_31/HBM_MEM16]
assign_bd_address -offset 0x0000000110000000 -range 256M -target_address_space [get_bd_addr_spaces shell_axi_dma] [get_bd_addr_segs hbm/SAXI_31/HBM_MEM17]
assign_bd_address -offset 0x0000000120000000 -range 256M -target_address_space [get_bd_addr_spaces shell_axi_dma] [get_bd_addr_segs hbm/SAXI_31/HBM_MEM18]
assign_bd_address -offset 0x0000000130000000 -range 256M -target_address_space [get_bd_addr_spaces shell_axi_dma] [get_bd_addr_segs hbm/SAXI_31/HBM_MEM19]
assign_bd_address -offset 0x0000000140000000 -range 256M -target_address_space [get_bd_addr_spaces shell_axi_dma] [get_bd_addr_segs hbm/SAXI_31/HBM_MEM20]
assign_bd_address -offset 0x0000000150000000 -range 256M -target_address_space [get_bd_addr_spaces shell_axi_dma] [get_bd_addr_segs hbm/SAXI_31/HBM_MEM21]
assign_bd_address -offset 0x0000000160000000 -range 256M -target_address_space [get_bd_addr_spaces shell_axi_dma] [get_bd_addr_segs hbm/SAXI_31/HBM_MEM22]
assign_bd_address -offset 0x0000000170000000 -range 256M -target_address_space [get_bd_addr_spaces shell_axi_dma] [get_bd_addr_segs hbm/SAXI_31/HBM_MEM23]
assign_bd_address -offset 0x0000000180000000 -range 256M -target_address_space [get_bd_addr_spaces shell_axi_dma] [get_bd_addr_segs hbm/SAXI_31/HBM_MEM24]
assign_bd_address -offset 0x0000000190000000 -range 256M -target_address_space [get_bd_addr_spaces shell_axi_dma] [get_bd_addr_segs hbm/SAXI_31/HBM_MEM25]
assign_bd_address -offset 0x00000001A0000000 -range 256M -target_address_space [get_bd_addr_spaces shell_axi_dma] [get_bd_addr_segs hbm/SAXI_31/HBM_MEM26]
assign_bd_address -offset 0x00000001B0000000 -range 256M -target_address_space [get_bd_addr_spaces shell_axi_dma] [get_bd_addr_segs hbm/SAXI_31/HBM_MEM27]
assign_bd_address -offset 0x00000001C0000000 -range 256M -target_address_space [get_bd_addr_spaces shell_axi_dma] [get_bd_addr_segs hbm/SAXI_31/HBM_MEM28]
assign_bd_address -offset 0x00000001D0000000 -range 256M -target_address_space [get_bd_addr_spaces shell_axi_dma] [get_bd_addr_segs hbm/SAXI_31/HBM_MEM29]
assign_bd_address -offset 0x00000001E0000000 -range 256M -target_address_space [get_bd_addr_spaces shell_axi_dma] [get_bd_addr_segs hbm/SAXI_31/HBM_MEM30]
assign_bd_address -offset 0x00000001F0000000 -range 256M -target_address_space [get_bd_addr_spaces shell_axi_dma] [get_bd_addr_segs hbm/SAXI_31/HBM_MEM31]
assign_bd_address -offset 0x00000000 -range 64K -target_address_space [get_bd_addr_spaces shell_axil_ctrl] [get_bd_addr_segs mnist_0/s_axi_control/Reg]
assign_bd_address -offset 0x00800000 -range 8K -target_address_space [get_bd_addr_spaces shell_axil_ctrl] [get_bd_addr_segs dummy_bram/S_AXI/Mem0]

validate_bd_design
save_bd_design
